# EAGLE design untitled (EAGLE 6.5.0)
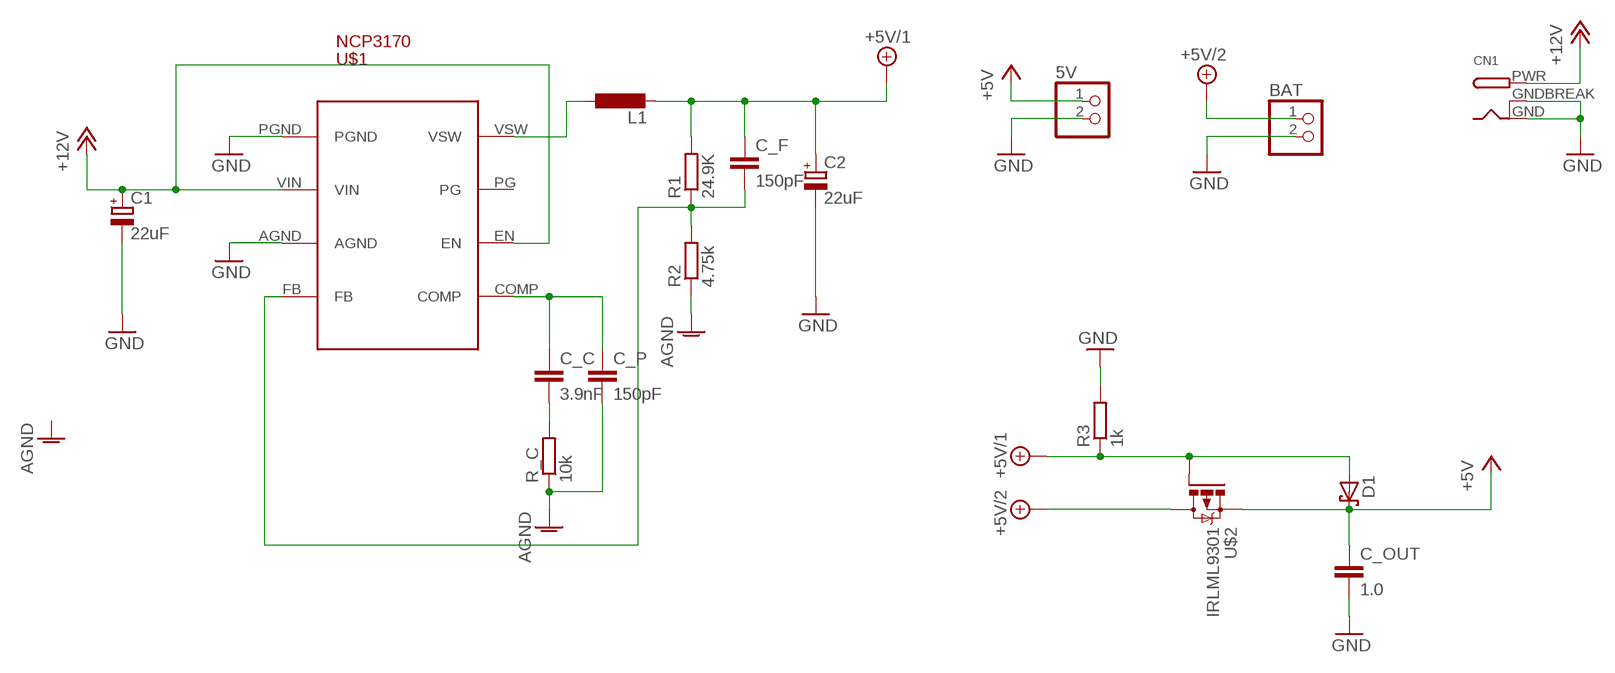
[diagram p0: schematic, sheet 1]

## Parts
5V  PINHD-1X2  [1X02]
BAT  PINHD-1X2  [1X02]
C1  22uF  CPOL-EUE2-5  [E2-5]
C2  22uF  CPOL-EUE2-5  [E2-5]
C_C  3.9nF  C-EUC0805K  [C0805K]
C_F  150pF  C-EUC0805K  [C0805K]
C_OUT  1.0  C-EUC0805K  [C0805K]
C_P  150pF  C-EUC0805K  [C0805K]
CN1  DCBARRELPTH  [DCJACK_2MM_PTH]
D1  SCHOTTKY-DIODESMD  [SMB]
L1  L-EU0207/7  [0207/7]
R1  24.9K  R-EU_R0805  [R0805]
R2  4.75k  R-EU_R0805  [R0805]
R3  1k  R-EU_R0805  [R0805]
R_C  10k  R-EU_R0805  [R0805]
U$1  NCP3170  [SOIC8]
U$2  IRLML9301  [SOT23]

## Nets
+5V: 5V.1 C_OUT.1 D1.C U$2.S
+5V/1: C2.+ C_F.1 D1.A L1.2 R1.2 R3.1 U$2.G
+5V/2: BAT.1 U$2.D
+12V: C1.+ CN1.PWR U$1.EN U$1.VIN
AGND: C_P.2 R2.1 R_C.1
GND: 5V.2 BAT.2 C1.- C2.- C_OUT.2 CN1.GND CN1.GNDBREAK R3.2 U$1.AGND U$1.PGND
N$2: C_C.1 C_P.1 U$1.COMP
N$3: C_C.2 R_C.2
N$5: C_F.2 R1.1 R2.2 U$1.FB
N$6: L1.1 U$1.VSW
Unconnected: U$1.PG

## Library data of the parts
5V BAT = pinhead:PINHD-1X2: PIN HEADER
C1 C2 = resistor:CPOL-EU: POLARIZED CAPACITOR, European symbol
C_C C_F C_OUT C_P = resistor:C-EU: CAPACITOR, European symbol
CN1 = adafruit:DCBARREL: 2.0mm DC Barrel Jack DCJACK_2MM_PTH - Through Hole Jack (4UConnector: 05537)
D1 = diode:SCHOTTKY-DIODE: Schottky Diode
L1 = resistor:L-EU: INDUCTOR, European symbol
R1-R3 R_C = resistor:R-EU_: RESISTOR, European symbol
U$1 = mylib:NCP3170
U$2 = mylib:IRLML9301

## Board
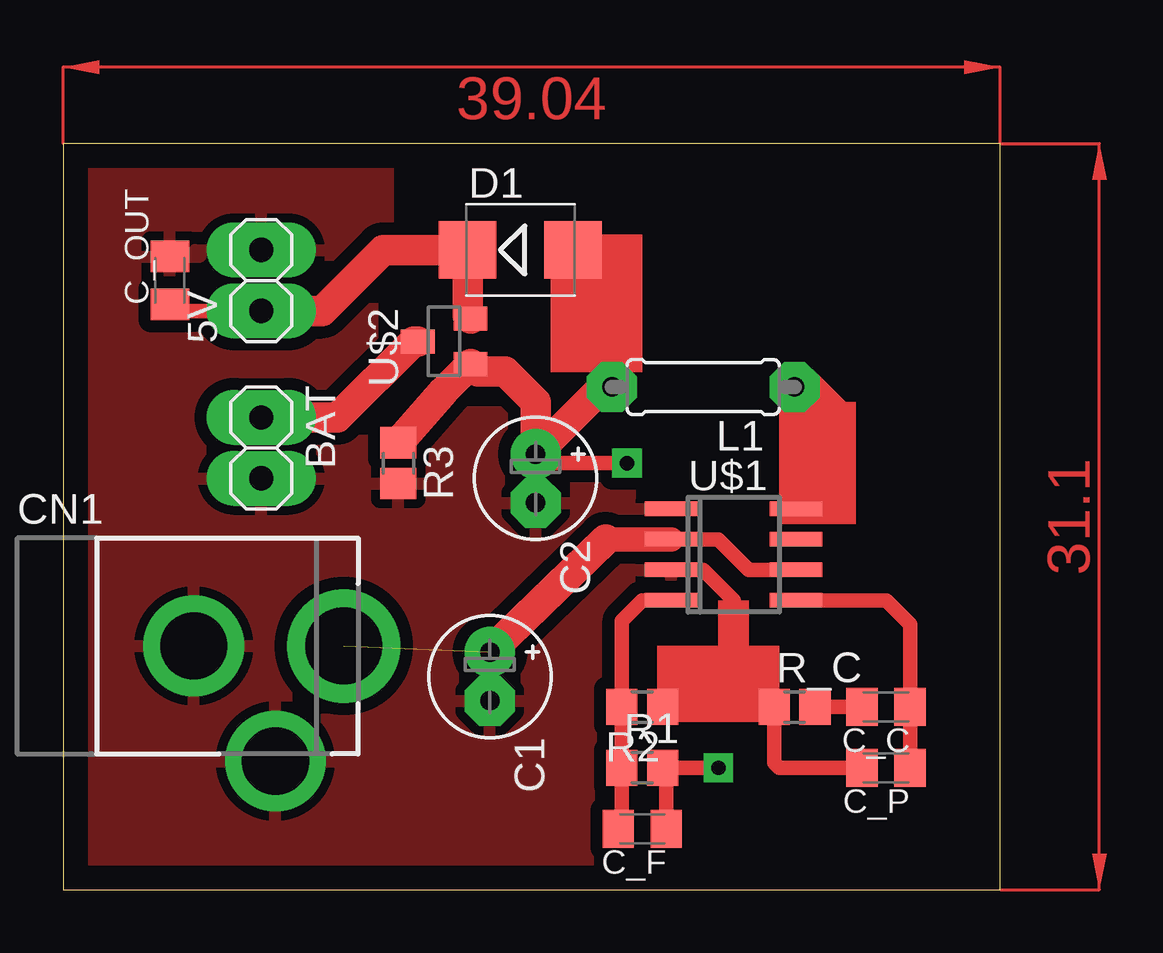
[diagram p1: board, top side]
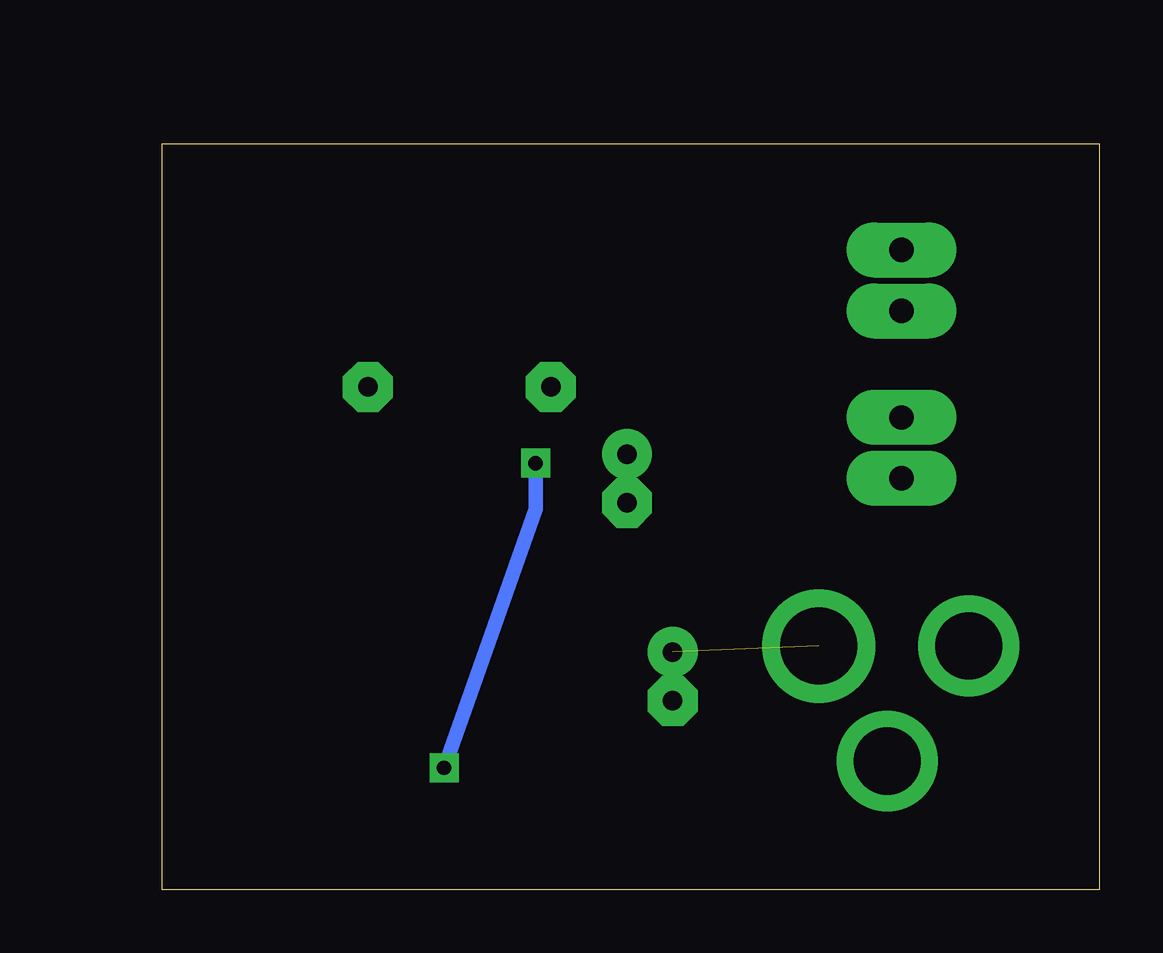
[diagram p2: board, bottom side, seen from below]

Size 39.04 x 31.1 mm. Coordinates in mm from the lower left corner, seen from the top.
Outline: 0,0 39.04,0 39.04,31.1 0,31.1 0,0
Copper layers (1*16): Top 0.035mm / dielectric 1.5mm / Bottom 0.035mm
Design rules "default": minimum track width 10mil, minimum drill 32mil, track to track 12mil, track to pad 12mil, pad to pad 12mil, via to via 12mil, smd to smd 8mil, copper to edge 40mil, drill to drill 40mil, minimum pad ring 25mil, minimum via ring 12mil, stop-mask expansion 4mil, vias tented up to drill 0mil, thermal gap 15mil
tRestrict: area 14,21 to 19.7,24.8; area 24.1,18.4 to 38.1,30.5; area 30.5,7 to 38.1,18.4; area 14.6,24.8 to 23.5,30.5; area 25.4,14 to 29.8,17.8

### Footprints (pad centres in the part's own frame; a part is rotated, then mirrored left to right if it is on the bottom)
1X02 = drill 1.016 long: 1 -1.27,0; 2 1.27,0
E2-5 = drill 0.813 pad 1.27: + -1.016,0 | drill 0.813 pad 1.27 octagon: - 1.016,0
C0805K = smd 1.3 x 1.6: 1 -1,0; 2 1,0
DCJACK_2MM_PTH = drill 2.8: GND 0,7.35; GNDBREAK 4.8,10.75 | drill 3.2: PWR 0,13.6
SMB = smd 2.4 x 2.4: A 2.2,0; C -2.2,0
0207/7 = drill 0.813 octagon: 1 -3.81,0; 2 3.81,0
R0805 = smd 1.3 x 1.5: 1 -0.85,0; 2 0.85,0
SOIC8 = smd 0.6 x 2.2: AGND 0.635,-2.6; COMP 1.905,2.6; EN 0.635,2.6; FB 1.905,-2.6; PG -0.635,2.6; PGND -1.905,-2.6; VIN -0.635,-2.6; VSW -1.905,2.6
SOT23 = smd 1 x 1.4: D 0,1.1; G -0.95,-1.1; S 0.95,-1.1

### Placement (x,y rotation side)
5V  8.26,25.4 90 top
BAT  8.26,18.41 270 top
C1  17.78,8.89 270 top
C2  19.68,17.14 270 top
C_C  34.29,7.62 180 top
C_F  24.13,2.54 180 top
C_OUT  4.44,25.4 90 top
C_P  34.29,5.08 180 top
CN1  -1.91,10.16 270 top
D1  19.05,26.67 0 top
L1  26.67,20.95 180 top
R1  24.13,5.08 0 top
R2  24.13,7.62 180 top
R3  13.97,17.78 270 top
R_C  30.48,7.62 0 top
U$1  27.94,13.97 270 top
U$2  15.88,22.86 90 top

### Tracks (layer width: path | path; a pad name or v marks a point on that pad's centre or on a via)
+5V
  Top 0.61: 5V.1 4.71,24.13 C_OUT.1
  Top 1.27: U$2.S 16.85,23.93 D1.C 13.34,26.67 10.79,24.13 5V.1
+5V/1  (via drill 0.6)
  Top 0.61: C_F.1 25.13,4.93 R1.2 v27.3,5.08 | v23.49,17.78 20.07,17.78 C2.+
  Top 1.27: D1.A 22.86,25.06 L1.2 22.48,20.95 C2.+ 19.68,20.32 18.41,21.59 17.29,21.59 U$2.G 15.88,20.81 R3.1
  Bottom 0.61: v23.49,17.78 23.49,15.88 v27.3,5.08
+5V/2
  Top 1.27: U$2.D 14.61,22.86 11.43,19.68 BAT.1
+12V  (1 unrouted)
  Top 0.61: U$1.VIN 27.3,14.61 28.57,13.34 U$1.EN
  Top 1.016: U$1.VIN 22.61,14.61
  Top 1.27: 22.61,14.61 C1.+
AGND
  Top 0.61: C_P.2 29.84,5.08 29.63,5.29 R_C.1 27.94,7.62 27.94,12.07 26.67,13.34
  Top 1.27: R_C.1 R2.1
GND
  pour Top (isolate 0.508): 0,34.29 41.91,34.29 41.91,-6.99 0,-6.99
N$2
  Top 0.61: U$1.COMP 34.29,12.07 35.29,11.07 C_C.1 C_P.1
N$3
  Top 0.61: C_C.2 R_C.2
N$5
  Top 0.61: U$1.FB 24.13,12.07 23.28,11.21 R2.2 R1.1 23.28,2.69 C_F.2
N$6
  Top 0.61: 32.38,16.51 31.75,15.88 U$1.VSW
  Top 1.27: L1.1 31.12,20.95 32.38,19.68 32.38,17.14 32.38,16.51
(copper drawn outside any net)
  shapes: Top area x7